# Altium schematic sheet UnitA.SchDoc
size 297 x 209 mm
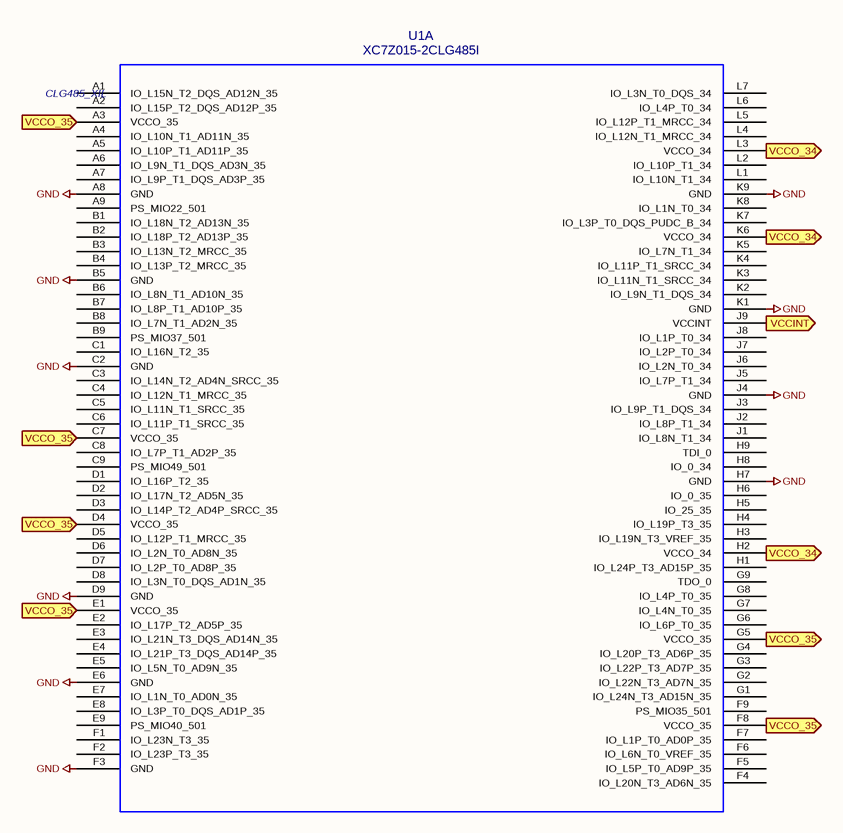
[diagram p0: UnitA.SchDoc]

## Parts
U1  XC7Z015-2CLG485I  [CLG485_XIL]  (part A of 5)

## Ports
VCCINT (in), VCCO_34 (in), VCCO_35 (in)

## Nets
GND: U1.A8(GND) U1.B5(GND) U1.C2(GND) U1.D9(GND) U1.E6(GND) U1.F3(GND) U1.H7(GND) U1.J4(GND) U1.K1(GND) U1.K9(GND)
VCCINT: U1.J9(VCCINT) ; port VCCINT
VCCO_34: U1.H2(VCCO_34) U1.K6(VCCO_34) U1.L3(VCCO_34) ; port VCCO_34
VCCO_35: U1.A3(VCCO_35) U1.C7(VCCO_35) U1.D4(VCCO_35) U1.E1(VCCO_35) U1.F8(VCCO_35) U1.G5(VCCO_35) ; port VCCO_35

Not connected (* = marked no-connect by the designer): U1 A1(IO_L15N_T2_DQS_AD12N_35) A2(IO_L15P_T2_DQS_AD12P_35) A4(IO_L10N_T1_AD11N_35) A5(IO_L10P_T1_AD11P_35) A6(IO_L9N_T1_DQS_AD3N_35) A7(IO_L9P_T1_DQS_AD3P_35) A9(PS_MIO22_501) B1(IO_L18N_T2_AD13N_35) B2(IO_L18P_T2_AD13P_35) B3(IO_L13N_T2_MRCC_35) B4(IO_L13P_T2_MRCC_35) B6(IO_L8N_T1_AD10N_35) B7(IO_L8P_T1_AD10P_35) B8(IO_L7N_T1_AD2N_35) B9(PS_MIO37_501) C1(IO_L16N_T2_35) C3(IO_L14N_T2_AD4N_SRCC_35) C4(IO_L12N_T1_MRCC_35) C5(IO_L11N_T1_SRCC_35) C6(IO_L11P_T1_SRCC_35) C8(IO_L7P_T1_AD2P_35) C9(PS_MIO49_501) D1(IO_L16P_T2_35) D2(IO_L17N_T2_AD5N_35) D3(IO_L14P_T2_AD4P_SRCC_35) D5(IO_L12P_T1_MRCC_35) D6(IO_L2N_T0_AD8N_35) D7(IO_L2P_T0_AD8P_35) D8(IO_L3N_T0_DQS_AD1N_35) E2(IO_L17P_T2_AD5P_35) E3(IO_L21N_T3_DQS_AD14N_35) E4(IO_L21P_T3_DQS_AD14P_35) E5(IO_L5N_T0_AD9N_35) E7(IO_L1N_T0_AD0N_35) E8(IO_L3P_T0_DQS_AD1P_35) E9(PS_MIO40_501) F1(IO_L23N_T3_35) F2(IO_L23P_T3_35) F4(IO_L20N_T3_AD6N_35) F5(IO_L5P_T0_AD9P_35) F6(IO_L6N_T0_VREF_35) F7(IO_L1P_T0_AD0P_35) F9(PS_MIO35_501) G1(IO_L24N_T3_AD15N_35) G2(IO_L22N_T3_AD7N_35) G3(IO_L22P_T3_AD7P_35) G4(IO_L20P_T3_AD6P_35) G6(IO_L6P_T0_35) G7(IO_L4N_T0_35) G8(IO_L4P_T0_35) G9(TDO_0) H1(IO_L24P_T3_AD15P_35) H3(IO_L19N_T3_VREF_35) H4(IO_L19P_T3_35) H5(IO_25_35) H6(IO_0_35) H8(IO_0_34) H9(TDI_0) J1(IO_L8N_T1_34) J2(IO_L8P_T1_34) J3(IO_L9P_T1_DQS_34) J5(IO_L7P_T1_34) J6(IO_L2N_T0_34) J7(IO_L2P_T0_34) J8(IO_L1P_T0_34) K2(IO_L9N_T1_DQS_34) K3(IO_L11N_T1_SRCC_34) K4(IO_L11P_T1_SRCC_34) K5(IO_L7N_T1_34) K7(IO_L3P_T0_DQS_PUDC_B_34) K8(IO_L1N_T0_34) L1(IO_L10N_T1_34) L2(IO_L10P_T1_34) L4(IO_L12N_T1_MRCC_34) L5(IO_L12P_T1_MRCC_34) L6(IO_L4P_T0_34) L7(IO_L3N_T0_DQS_34)

## Notes on the sheet
- 1
- 2
- 3
- 4
- 5
- 6
- A
- B
- C
- D
- Title:
- File: UnitA.kicad_sch
- Sheet: /
- KiCad E.D.A.  kicad (5.1.4)-1
- Size: A4
- Date:
- Rev:
- Id: 1/1

## Library data of the parts
U1 = XC7Z015-2CLG485I: Value: XC7Z015-2CLG485I